# EAGLE design lcd232 (EAGLE 6.4)
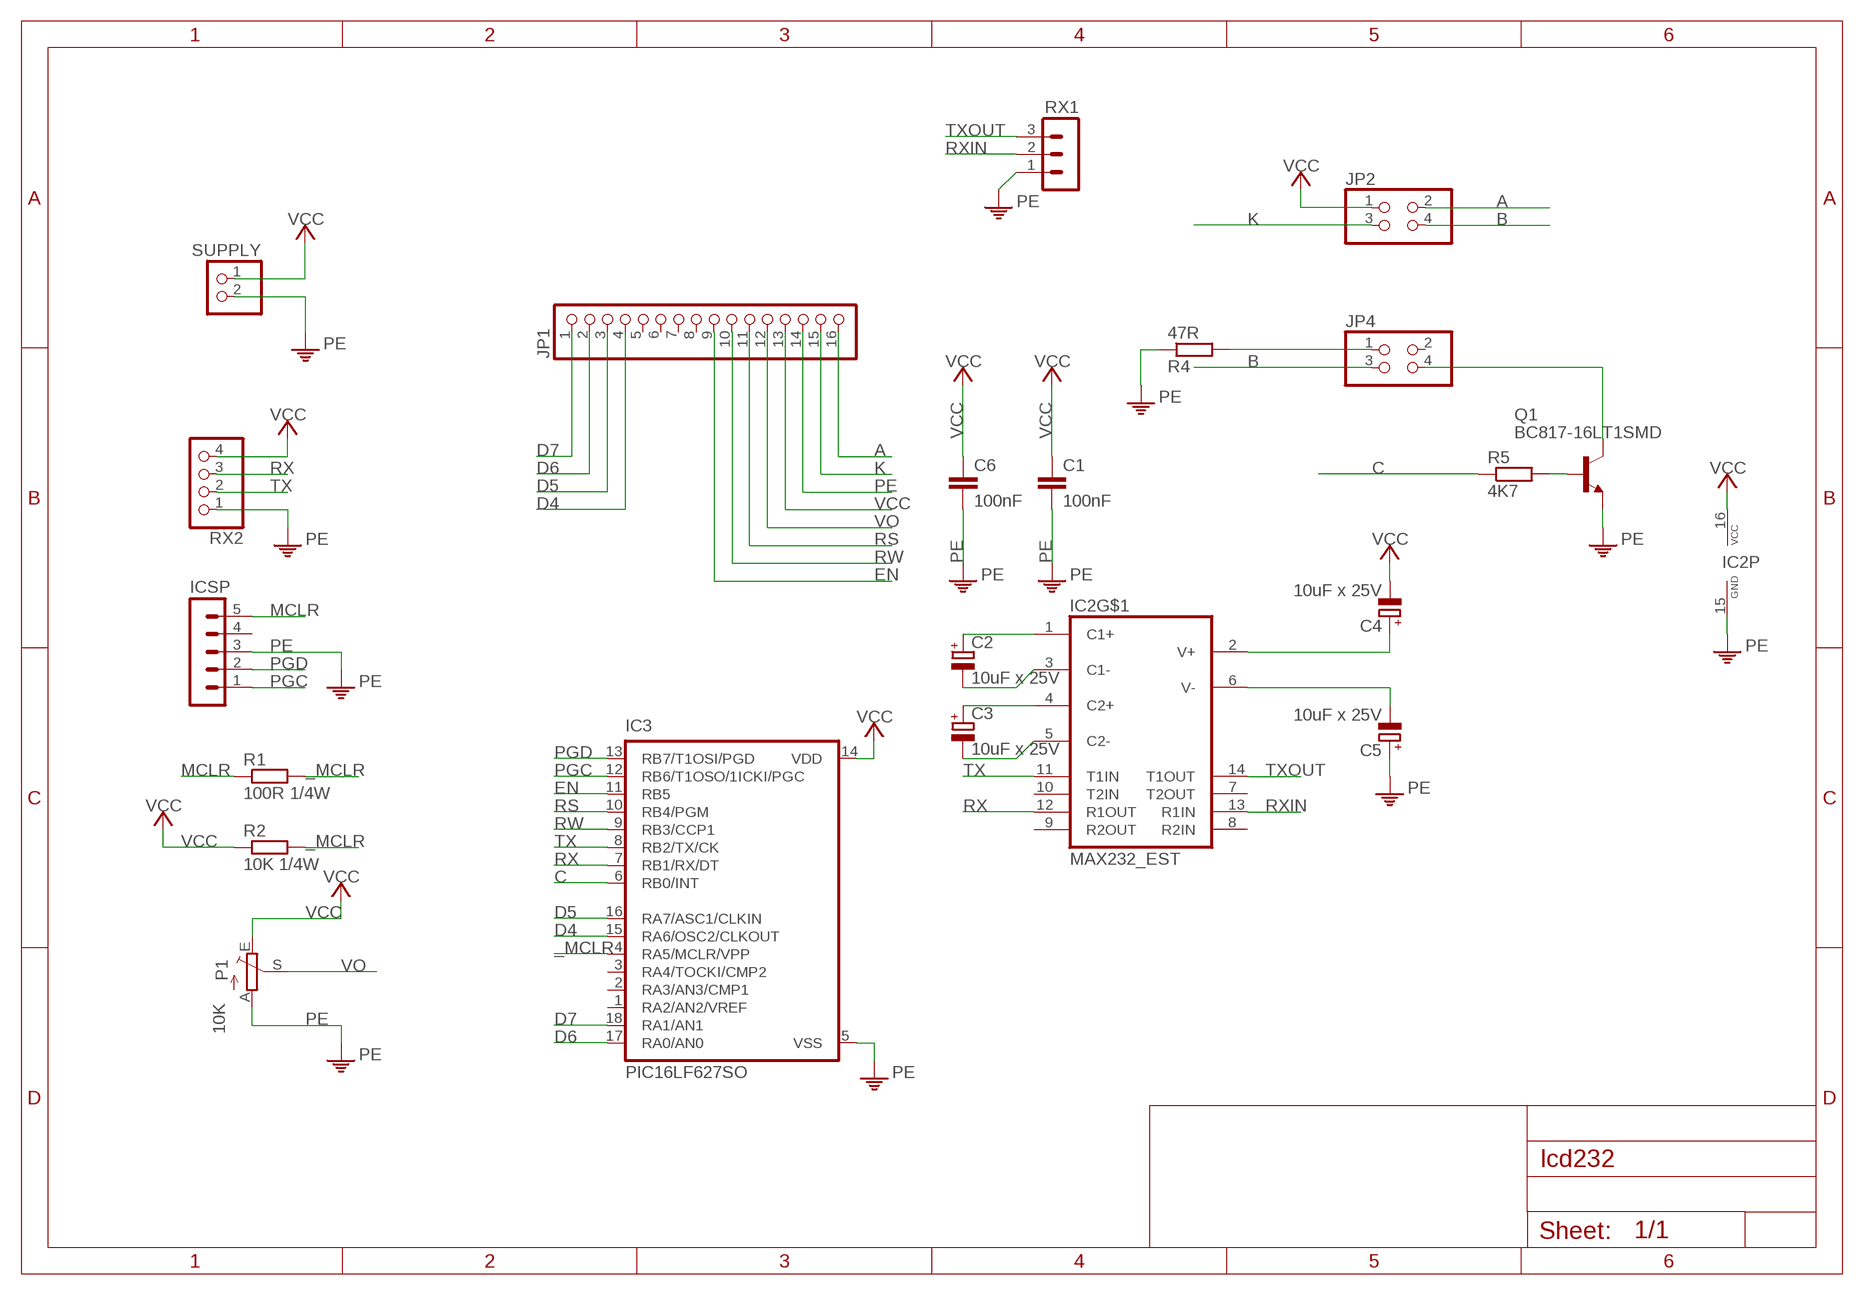
[diagram p0: schematic, sheet 1]

## Parts
C1  100nF  C-EUC0805  [C0805]
C2  10uF x 25V  CPOL-EUE2-4  [E2-4]
C3  10uF x 25V  CPOL-EUE2-4  [E2-4]
C4  10uF x 25V  CPOL-EUE2-4  [E2-4]
C5  10uF x 25V  CPOL-EUE2-4  [E2-4]
C6  100nF  C-EUC0805  [C0805]
IC2  MAX232_EST  [SO16_EST]
IC3  PIC16LF627SO  [SO-18W]
ICSP  MA05-1  [MA05-1]
JP1  PINHD-1X16  [1X16]
JP2  PINHD-2X2  [2X02]
JP4  PINHD-2X2  [2X02]
P1  10K  TRIM_EU-CA9V  [CA9V]
Q1  BC817-16LT1SMD  [SOT23-BEC]
R1  100R 1/4W  R-EU_M0805  [M0805]
R2  10K 1/4W  R-EU_M0805  [M0805]
R4  47R  R-EU_M0805  [M0805]
R5  4K7  R-EU_M0805  [M0805]
RX1  MA03-1  [MA03-1]
RX2  PINHD-1X4  [1X04]
SUPPLY  PINHD-1X2  [1X02]

## Nets
_MCLR: IC3.4(RA5/MCLR/VPP) R1.2 R2.2
A: JP1.16 JP2.2
B: JP2.4 JP4.3
C: IC3.6(RB0/INT) R5.1
D4: IC3.15(RA6/OSC2/CLKOUT) JP1.4
D5: IC3.16(RA7/ASC1/CLKIN) JP1.3
D6: IC3.17(RA0/AN0) JP1.2
D7: IC3.18(RA1/AN1) JP1.1
EN: IC3.11(RB5) JP1.9
K: JP1.15 JP2.3
MCLR: ICSP.5 R1.1
N$1: C3.+ IC2.4(C2+)
N$2: C3.- IC2.5(C2-)
N$4: Q1.B R5.2
N$8: C2.+ IC2.1(C1+)
N$9: C2.- IC2.3(C1-)
N$10: C4.+ IC2.2(V+)
N$11: JP4.4 Q1.C
N$12: C5.- IC2.6(V-)
N$14: JP4.1 R4.2
PE: C1.2 C5.+ C6.2 IC2.15(P:GND) IC3.5(VSS) ICSP.3 JP1.14 P1.A Q1.E R4.1 RX1.1 RX2.1 SUPPLY.2
PGC: IC3.12(RB6/T1OSO/1ICKI/PGC) ICSP.1
PGD: IC3.13(RB7/T1OSI/PGD) ICSP.2
RS: IC3.10(RB4/PGM) JP1.11
RW: IC3.9(RB3/CCP1) JP1.10
RX: IC2.12(R1OUT) IC3.7(RB1/RX/DT) RX2.3
RXIN: IC2.13(R1IN) RX1.2
TX: IC2.11(T1IN) IC3.8(RB2/TX/CK) RX2.2
TXOUT: IC2.14(T1OUT) RX1.3
VCC: C1.1 C4.- C6.1 IC2.16(P:VCC) IC3.14(VDD) JP1.13 JP2.1 P1.E R2.1 RX2.4 SUPPLY.1
VO: JP1.12 P1.S
Unconnected: IC2.7(T2OUT) IC2.8(R2IN) IC2.9(R2OUT) IC2.10(T2IN) IC3.1(RA2/AN2/VREF) IC3.2(RA3/AN3/CMP1) IC3.3(RA4/TOCKI/CMP2) ICSP.4 JP1.5 JP1.6 JP1.7 JP1.8 JP4.2

## Library data of the parts
C1 C6 = rcl:C-EU: CAPACITOR, European symbol
C2-C5 = rcl:CPOL-EU: POLARIZED CAPACITOR, European symbol
IC2 = maxim:MAX232_EST: RS232 TRANSEIVER
IC3 = microchip:PIC16*F62: FLASH-Based 8-Bit CMOS Microcontroller Source: http://ww1.microchip.com/downloads/en/DeviceDoc/40300C.pdf; MF: MICROCHIP; MPN: PIC16LF627A-I/SO; OC_FARNELL: 1579593; OC_NEWARK: 92C4841
ICSP = con-lstb:MA05-1: PIN HEADER; OC_FARNELL: unknown; OC_NEWARK: unknown
JP1 = pinhead:PINHD-1X16: PIN HEADER
JP2 JP4 = pinhead:PINHD-2X2: PIN HEADER
P1 = pot:TRIM_EU-: POTENTIOMETER
Q1 = transistor-npn:BC817*: NPN Transistor
R1 R2 R4 R5 = rcl:R-EU_: RESISTOR, European symbol
RX1 = con-lstb:MA03-1: PIN HEADER; OC_FARNELL: unknown; OC_NEWARK: unknown
RX2 = pinhead:PINHD-1X4: PIN HEADER
SUPPLY = pinhead:PINHD-1X2: PIN HEADER

## Board
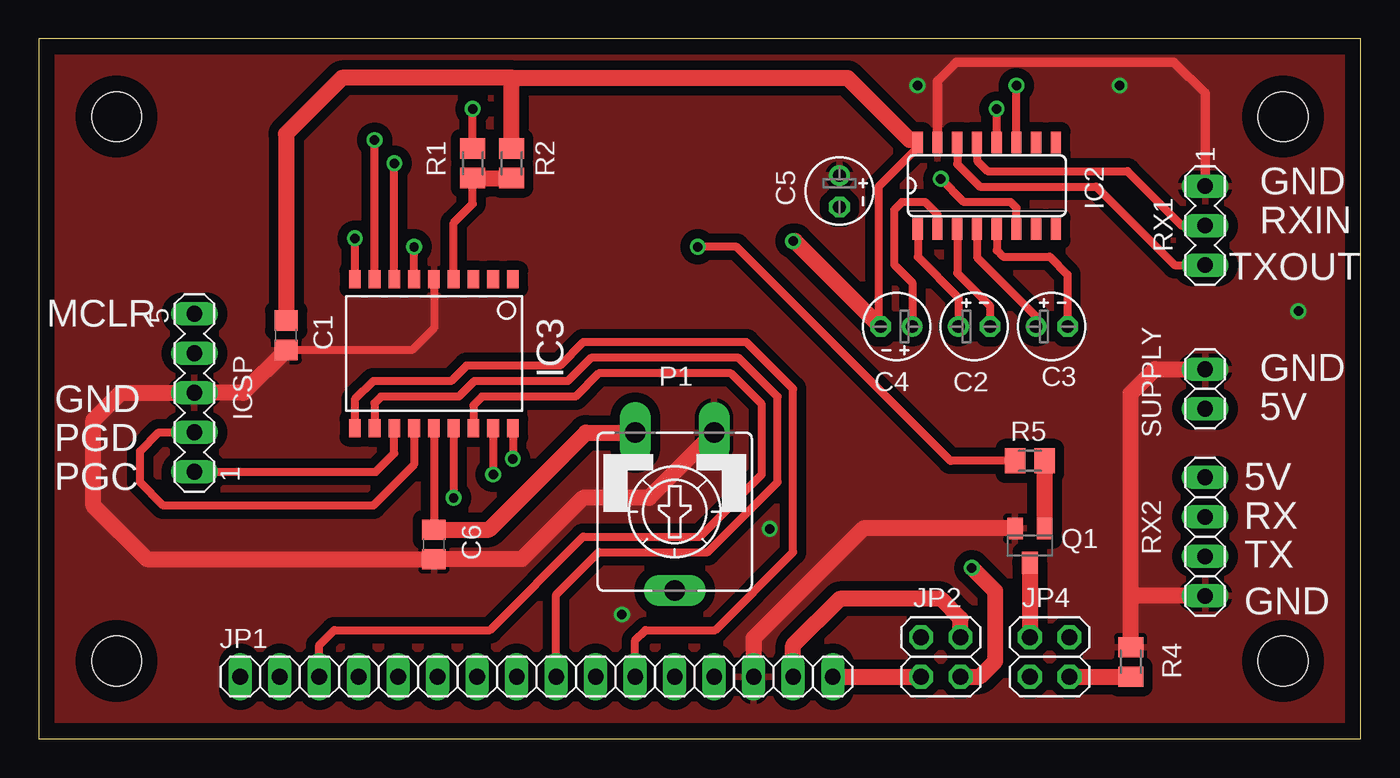
[diagram p1: board, top side]
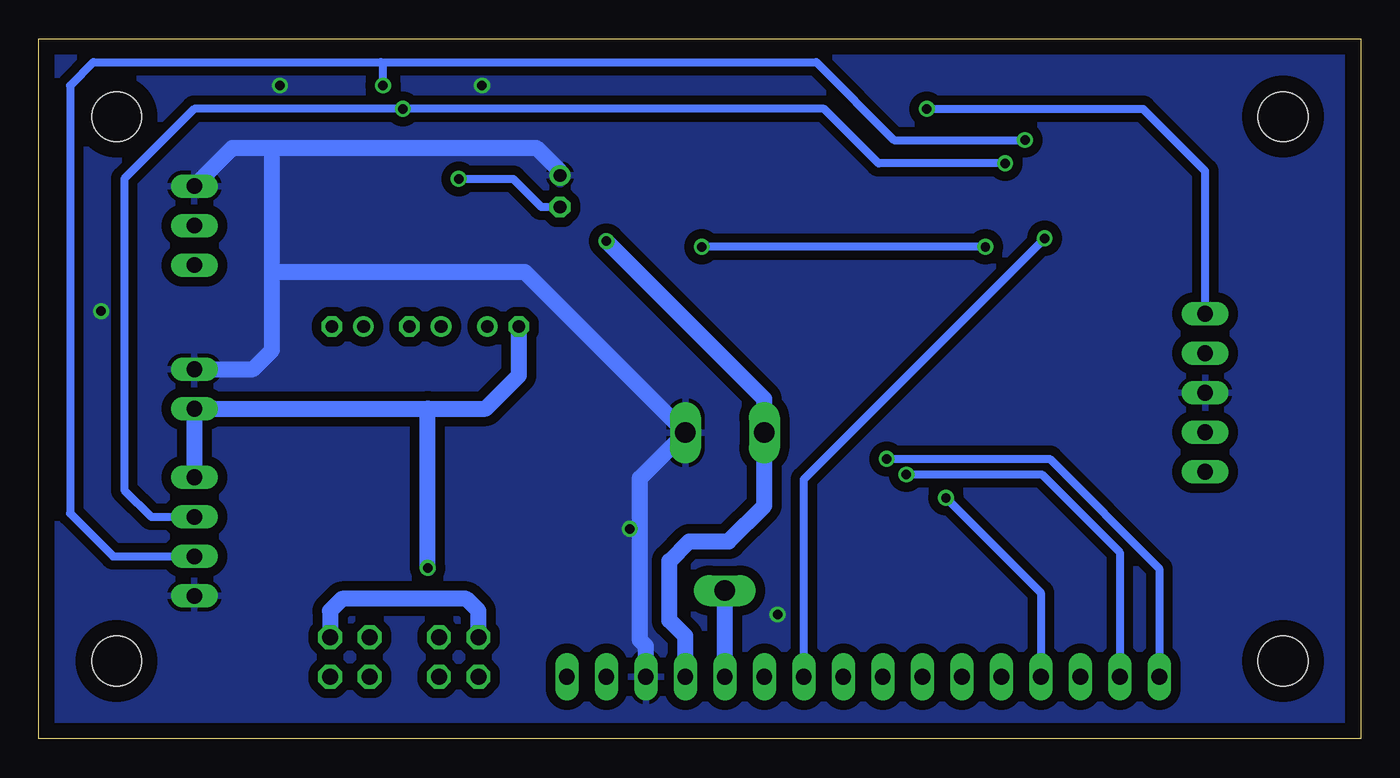
[diagram p2: board, bottom side, seen from below]

Size 85 x 45 mm. Coordinates in mm from the lower left corner, seen from the top.
Outline: 0,0 85,0 85,45 0,45 0,0
Copper layers (1*16): Top 0.035mm / dielectric 1.5mm / Bottom 0.035mm
Design rules: minimum track width 10mil, minimum drill 24mil, track to track 8mil, track to pad 8mil, pad to pad 8mil, via to via 8mil, smd to smd 8mil, copper to edge 40mil, drill to drill 8mil, minimum pad ring 10mil, minimum via ring 8mil, stop-mask expansion 4mil, vias tented up to drill 0mil, thermal gap 10mil
Holes 3.2 mm at 5,40 80,40 80,5 5,5

### Footprints (pad centres in the part's own frame; a part is rotated, then mirrored left to right if it is on the bottom)
C0805 = smd 1.3 x 1.5: 1 -0.95,0; 2 0.95,0
E2-4 = drill 0.813 pad 1.27: + -1.016,0 | drill 0.813 pad 1.27 octagon: - 1.016,0
SO16_EST = smd 0.66 x 1.4: 1 -4.445,-2.78; 2 -3.175,-2.78; 3 -1.905,-2.78; 4 -0.635,-2.78; 5 0.635,-2.78; 6 1.905,-2.78; 7 3.175,-2.78; 8 4.445,-2.78; 9 4.445,2.78; 10 3.175,2.78; 11 1.905,2.78; 12 0.635,2.78; 13 -0.635,2.78; 14 -1.905,2.78; 15 -3.175,2.78; 16 -4.445,2.78
SO-18W = smd 0.762 x 1.143: 1 -5.08,-4.788; 2 -3.81,-4.788; 3 -2.54,-4.788; 4 -1.27,-4.788; 5 0,-4.788; 6 1.27,-4.788; 7 2.54,-4.788; 8 3.81,-4.788; 9 5.08,-4.788; 10 5.08,4.788; 11 3.81,4.788; 12 2.54,4.788; 13 1.27,4.788; 14 0,4.788; 15 -1.27,4.788; 16 -2.54,4.788; 17 -3.81,4.788; 18 -5.08,4.788
MA05-1 = drill 1.016 long: 1 -5.08,0; 2 -2.54,0; 3 0,0; 4 2.54,0; 5 5.08,0
1X16 = drill 1.016 long: 1 -19.05,0; 2 -16.51,0; 3 -13.97,0; 4 -11.43,0; 5 -8.89,0; 6 -6.35,0; 7 -3.81,0; 8 -1.27,0; 9 1.27,0; 10 3.81,0; 11 6.35,0; 12 8.89,0; 13 11.43,0; 14 13.97,0; 15 16.51,0; 16 19.05,0
2X02 = drill 1.016 octagon: 1 -1.27,-1.27; 2 -1.27,1.27; 3 1.27,-1.27; 4 1.27,1.27
CA9V = drill 1.321 long: A -2.54,-5.08; E 2.54,-5.08; S 0,5.08
SOT23-BEC = smd 1 x 1.4: B -0.95,-1.1; C 0,1.1; E 0.95,-1.1
M0805 = smd 1.3 x 1.6: 1 -0.95,0; 2 0.95,0
MA03-1 = drill 1.016 long: 1 -2.54,0; 2 0,0; 3 2.54,0
1X04 = drill 1.016 long: 1 -3.81,0; 2 -1.27,0; 3 1.27,0; 4 3.81,0
1X02 = drill 1.016 long: 1 -1.27,0; 2 1.27,0

### Placement (x,y rotation side)
C1  15.9,25.95 270 top
C2  60.15,26.5 0 top
C3  65.14,26.5 0 top
C4  55.15,26.5 180 top
C5  51.48,35.21 270 top
C6  25.4,12.5 270 top
IC2  60.96,35.56 0 top
IC3  25.4,24.77 180 top
ICSP  10,22.25 90 top
JP1  32,4 0 top
JP2  58,5.27 90 top
JP4  65,5.27 90 top
P1  40.89,14.61 180 top
Q1  63.73,12.43 180 top
R1  27.9,37 270 top
R2  30.4,37 270 top
R4  70.22,4.95 270 top
R5  63.73,17.88 0 top
RX1  75,33 270 top
RX2  75,13 90 top
SUPPLY  75,22.5 90 top

### Tracks (layer width: path | path; a pad name or v marks a point on that pad's centre or on a via)
_MCLR
  Top 0.5: IC3.4 26.67,33.17 27.9,34.4 R1.2
  Top 1.016: R1.2 R2.2
A
  Top 1.016: JP1.16 JP2.2
B
  Bottom 1.016: JP2.4 56.73,8.23 57.5,9 65.5,9 66.27,8.23 JP4.3
C  (via drill 0.61)
  Top 0.5: IC3.6 v24.13,31.63 | R5.1 58.62,17.88 44.87,31.63 v42.37,31.63
  Bottom 0.5: v24.13,31.63 v42.37,31.63
D4  (via drill 0.61)
  Top 0.5: IC3.15 v26.67,15.5
  Bottom 0.5: JP1.4 20.57,9.4 v26.67,15.5
D5
  Top 0.5: JP1.3 18.03,6.03 19,7 29,7 35,13 42.5,13 46.5,17 46.5,21.5 44.5,23.5 36,23.5 34.5,22 28.5,22 27.94,21.44 IC3.16
D6  (via drill 0.61)
  Top 0.5: IC3.17 v29.21,17
  Bottom 0.5: v29.21,17 20.5,17 15.49,11.99 JP1.2
D7  (via drill 0.61)
  Top 0.5: IC3.18 v30.48,18
  Bottom 0.5: v30.48,18 20,18 12.95,10.95 JP1.1
EN
  Top 0.5: JP1.9 33.27,9.27 36,12 43,12 47.5,16.5 47.5,22 45,24.5 35.5,24.5 34,23 28,23 27,22 22,22 21.59,21.59 IC3.11
K
  Top 1.016: JP2.3 59.27,7.73 58,9 51.5,9 48.51,6.01 JP1.15
MCLR  (via drill 0.61)
  Top 0.5: R1.1 v27.9,40.5
  Bottom 0.5: ICSP.5 10,36.5 14,40.5 v27.9,40.5
N$1
  Top 0.5: IC2.4 60.33,30.96 64.12,27.17 C3.+
N$2
  Top 0.5: IC2.5 61.59,31.41 62,31 65,31 66.15,29.85 C3.-
N$4
  Top 1.016: Q1.B R5.2
N$8
  Top 0.5: IC2.1 56.52,30.98 59.13,28.37 C2.+
N$9
  Top 0.5: IC2.3 59.05,29.95 61.17,27.83 C2.-
N$10
  Top 0.5: IC2.2 57.78,33.72 57,34.5 55.5,34.5 55,34 55,30.5 56.17,29.33 C4.+
N$11
  Top 1.016: Q1.C JP4.4
N$12  (via drill 0.61)
  Top 0.5: IC2.6 62.87,34.13 62.5,34.5 59.5,34.5 v58,36
  Bottom 0.5: v58,36 54.5,36 52.69,34.19 C5.-
N$14
  Top 1.016: JP4.1 R4.2
PE  (via drill 0.61)
  Top 0.5: IC3.5 25.4,26.4 24,25 C1.2
  Top 0.61: IC2.15 57.78,42.28 59,43.5 73,43.5 75,41.5 RX1.1
  Top 1.016: R4.1 70.22,9 | 70.22,9 70.22,22.21 71.77,23.77 SUPPLY.2 | Q1.E 53.03,13.53 45.97,6.47 JP1.14 | C1.2 13.15,22.25 ICSP.3 5.25,22.25 3.5,20.5 3.5,15 6.95,11.55 C6.2 31.05,11.55 35,15.5 39.24,15.5 P1.A | RX2.1 70.41,9.19 70.22,9
  Bottom 1.016: JP1.14 45.97,5.96 46.35,6.35 46.35,16.76 P1.A 53.74,30 70,30 | SUPPLY.2 71.23,23.77 70,25 70,30 | 70,30 70,38 | RX1.1 72.54,38 70,38 | 70,38 53,38 51.48,36.48 C5.+
  other vias: 47,13.5 69.5,42 56.5,42 81,27.5 37.5,8
  pour Top (isolate 0.61): 0,0 85,0 85,45 0,45
  pour Bottom (isolate 0.61): 0,0 85,0 85,45 0,45
PGC
  Top 0.5: ICSP.1 21.67,17.17 22.86,18.36 IC3.12
PGD
  Top 0.5: IC3.13 24.13,17.63 21.5,15 8,15 6.5,16.5 6.5,18.5 7.71,19.71 ICSP.2
RS
  Top 0.5: JP1.11 38.35,6.35 39,7 43.5,7 48.5,12 48.5,22.5 45.5,25.5 35,25.5 33.5,24 27.5,24 26.5,23 21.5,23 20.32,21.82 IC3.10
RW  (via drill 0.61)
  Top 0.5: v20.32,32.18 IC3.9
  Bottom 0.5: JP1.10 35.81,16.69 v20.32,32.18
RX  (via drill 0.61)
  Top 0.5: IC3.7 v22.86,37 | IC2.12 v61.59,40.5
  Bottom 0.5: v22.86,37 31,37 34.5,40.5 v61.59,40.5 75,40.5 79.5,36 79.5,16 77.77,14.27 RX2.3
RXIN
  Top 0.5: IC2.13 60.33,37.17 61,36.5 70,36.5 73.5,33 RX1.2
TX  (via drill 0.61)
  Top 0.5: IC3.8 v21.59,38.5 | IC2.11 v62.87,42
  Bottom 0.5: 63,43.5 81.5,43.5 83,42 83,14.5 80.23,11.73 RX2.2 | 63,43.5 35,43.5 30,38.5 v21.59,38.5 | v62.87,42 62.87,43.37 63,43.5
TXOUT
  Top 0.5: IC2.14 59.05,36.95 60.5,35.5 68,35.5 73.04,30.46 RX1.3
VCC  (via drill 0.61)
  Top 0.254: 56.5,38.5 IC2.16 56.5,38
  Top 0.5: 56.5,38 54,35.5 54,26.63 C4.- | IC3.14 C6.1
  Top 0.61: 56,38.5 56.35,38.5 IC2.16
  Top 1.016: 56,38.5 52,42.5 30.5,42.5 | R2.1 30.4,42.4 30.5,42.5 | 30.5,42.5 19.5,42.5 15.9,38.9 C1.1 | C6.1 28.95,13.45 35.19,19.68 P1.E | JP2.1 60.5,4 61.5,5 61.5,9.5 v60,11 | C4.- 48.63,32 v48.5,32
  Bottom 1.016: JP1.13 43.43,6.6 44.45,7.62 44.45,11.43 43.18,12.7 40.64,12.7 38.35,14.99 P1.E 38.35,21.85 v48.5,32 | 60,21.23 SUPPLY.1 RX2.4 | v60,11 60,21.23 | 60,21.23 56.27,21.23 54.13,23.37 C4.-
VO
  Bottom 1.016: JP1.12 P1.S

### Text on the board
tNames: GND | RXIN | TXOUT | MCLR | GND | GND | 5V | PGD | PGC | 5V | RX | TX | GND